# EAGLE design TSAR_Actuator_Controller (EAGLE 9.6.2)

## Sheet 1 of 3: STM Morpho Connector
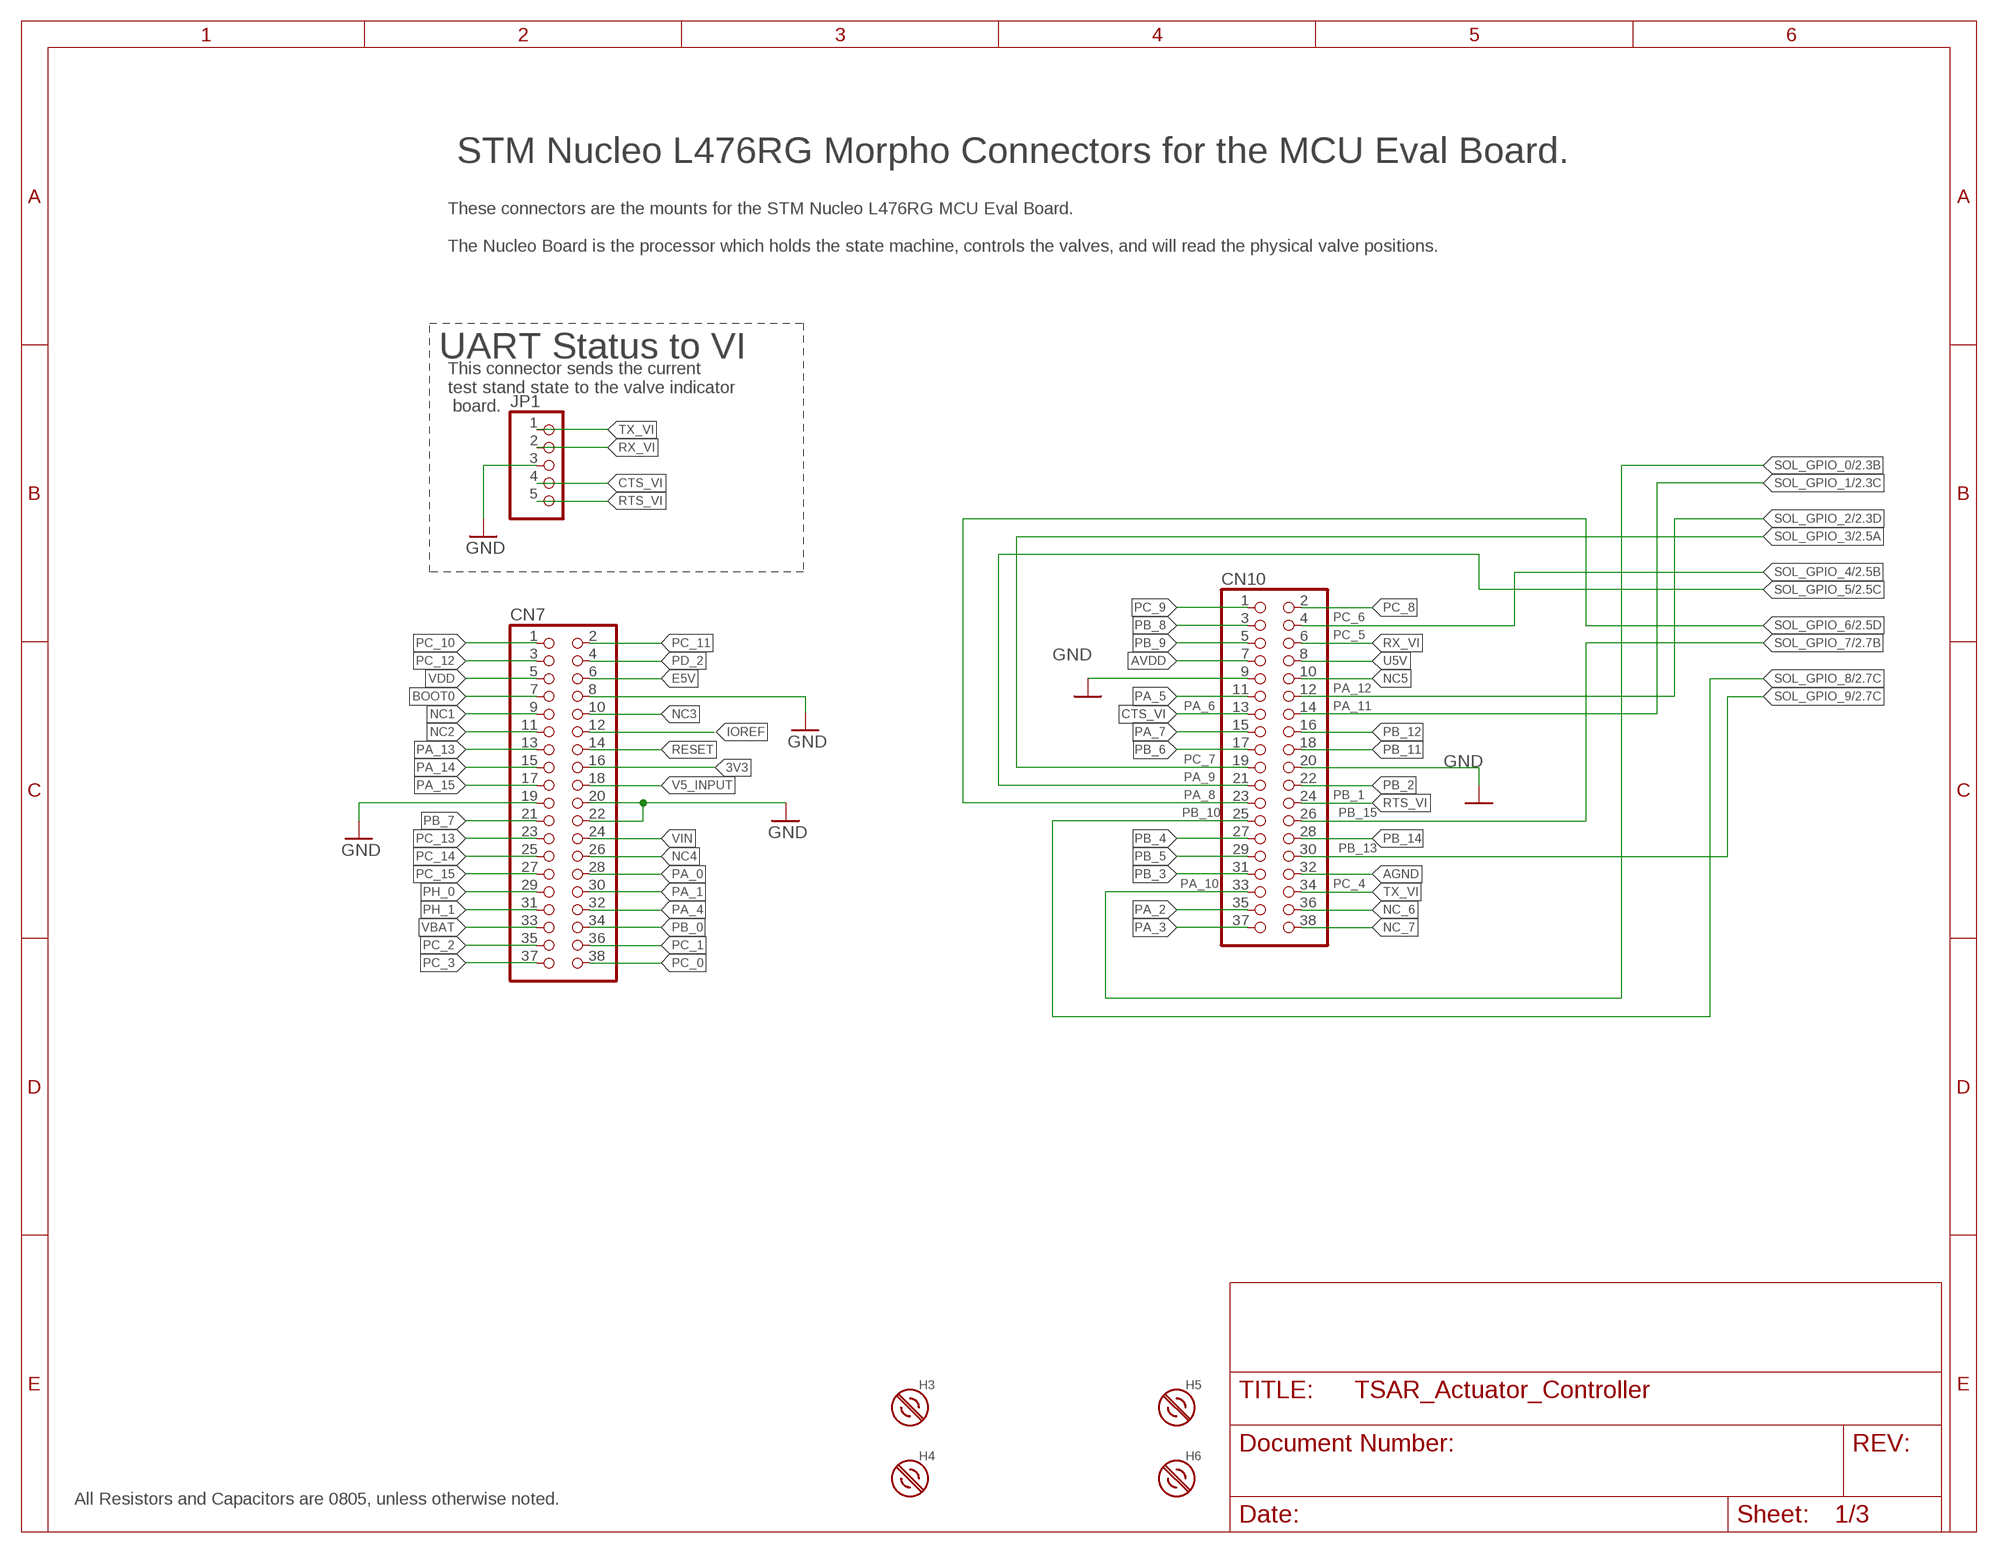
[diagram p0: schematic, sheet 1]

### Parts
CN7  PINHD-2X19  [2X19]
CN10  PINHD-2X19  [2X19]
H3  #4-BARE_MOUNTING_HOLE/.300  [#4/.300-BARE+STD_NUT_OR_STAR_WASHER]
H4  #4-BARE_MOUNTING_HOLE/.300  [#4/.300-BARE+STD_NUT_OR_STAR_WASHER]
H5  #4-BARE_MOUNTING_HOLE/.300  [#4/.300-BARE+STD_NUT_OR_STAR_WASHER]
H6  #4-BARE_MOUNTING_HOLE/.300  [#4/.300-BARE+STD_NUT_OR_STAR_WASHER]
JP1  PINHD-1X5  [1X05]

### Nets
3V3: CN7.16
AGND: CN10.32
AVDD: CN10.7
BOOT0: CN7.7
CTS_VI: CN10.13 JP1.4
E5V: CN7.6
GND: CN7.8 CN7.19 CN7.20 CN7.22 CN10.9 CN10.20 JP1.3 ; also sheet 2,3
IOREF: CN7.12
NC1: CN7.9
NC2: CN7.11
NC3: CN7.10
NC4: CN7.26
NC5: CN10.10
NC_6: CN10.36
NC_7: CN10.38
PA_0: CN7.28
PA_1: CN7.30
PA_2: CN10.35
PA_3: CN10.37
PA_4: CN7.32
PA_5: CN10.11
PA_7: CN10.15
PA_13: CN7.13
PA_14: CN7.15
PA_15: CN7.17
PB_0: CN7.34
PB_2: CN10.22
PB_3: CN10.31
PB_4: CN10.27
PB_5: CN10.29
PB_6: CN10.17
PB_7: CN7.21
PB_8: CN10.3
PB_9: CN10.5
PB_11: CN10.18
PB_12: CN10.16
PB_14: CN10.28
PC_0: CN7.38
PC_1: CN7.36
PC_2: CN7.35
PC_3: CN7.37
PC_8: CN10.2
PC_9: CN10.1
PC_10: CN7.1
PC_11: CN7.2
PC_12: CN7.3
PC_13: CN7.23
PC_14: CN7.25
PC_15: CN7.27
PD_2: CN7.4
PH_0: CN7.29
PH_1: CN7.31
RESET: CN7.14
RTS_VI: CN10.24 JP1.5
RX_VI: CN10.6 JP1.2
SOL_GPIO_0: CN10.33 ; also sheet 2
SOL_GPIO_1: CN10.14 ; also sheet 2
SOL_GPIO_2: CN10.12 ; also sheet 2
SOL_GPIO_3: CN10.19 ; also sheet 2
SOL_GPIO_4: CN10.4 ; also sheet 2
SOL_GPIO_5: CN10.21 ; also sheet 2
SOL_GPIO_6: CN10.23 ; also sheet 2
SOL_GPIO_7: CN10.26 ; also sheet 2
SOL_GPIO_8: CN10.25 ; also sheet 2
SOL_GPIO_9: CN10.30 ; also sheet 2
TX_VI: CN10.34 JP1.1
U5V: CN10.8
V5_INPUT: CN7.18
VBAT: CN7.33
VDD: CN7.5
VIN: CN7.24

### Notes on the sheet
- STM Nucleo L476RG Morpho Connectors for the MCU Eval Board.
- These connectors are the mounts for the STM Nucleo L476RG MCU Eval Board. 
  
  The Nucleo Board is the processor which holds the state machine, controls the valves, and will read the physical valve positions.
- UART Status to VI
- This connector sends the current 
  test stand state to the valve indicator
   board.
- PC_6
- PC_5
- PA_12
- PA_6 | PA_11
- PC_7
- PA_9
- PA_8 | PB_1
- PB_10 | PB_15
- PB_13
- PA_10 | PC_4
- All Resistors and Capacitors are 0805, unless otherwise noted.

## Sheet 2 of 3: Solenoid Switches
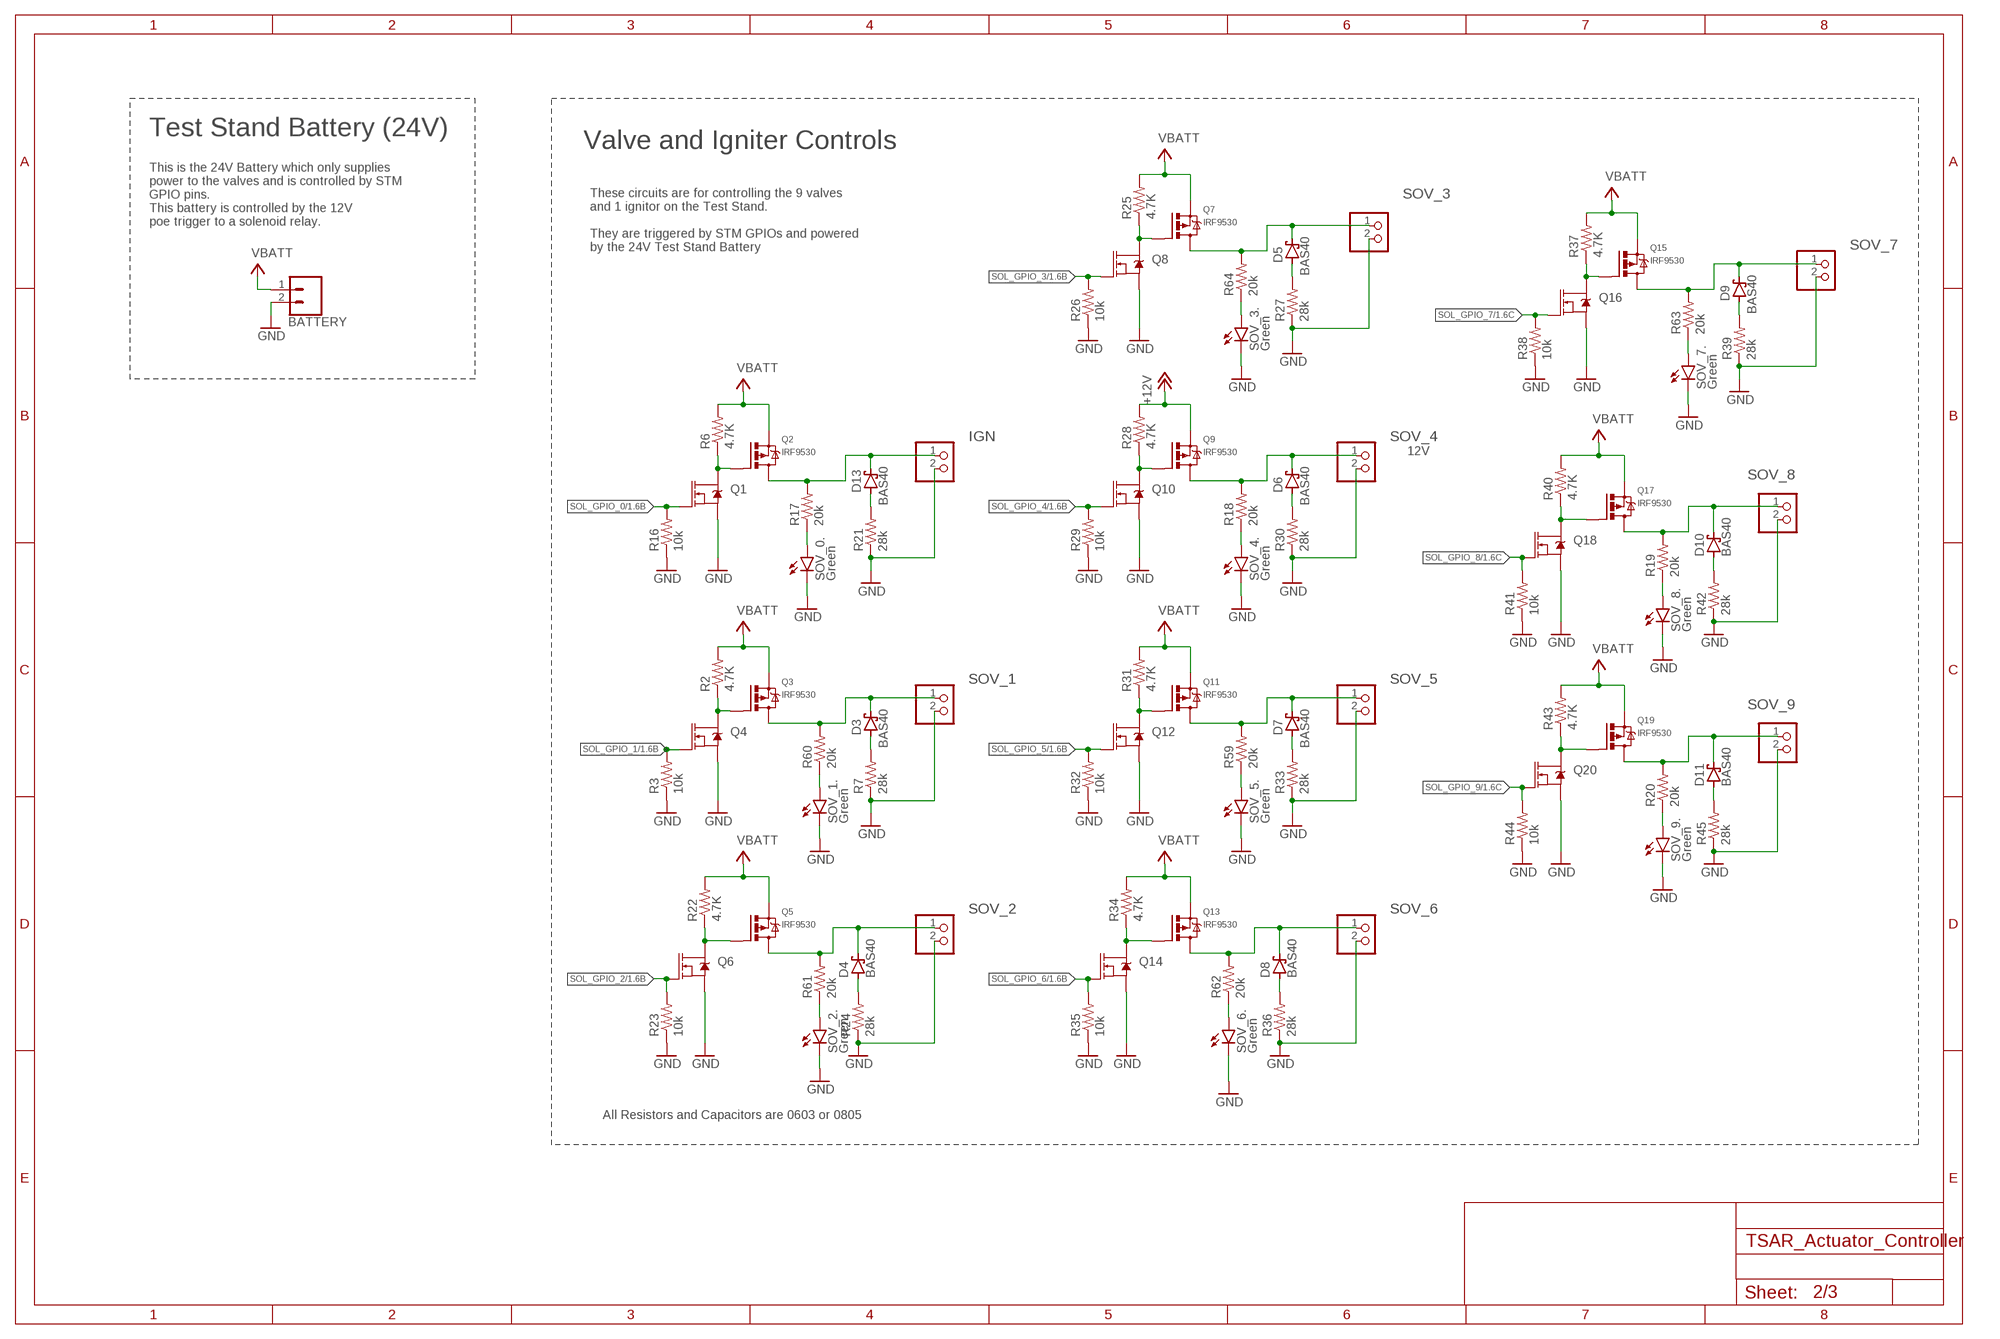
[diagram p1: schematic, sheet 2]

### Parts
BATTERY  CONN_02PTH4  [1X02_XTRA_BIG]
D3  BAS40  [SOT23]
D4  BAS40  [SOT23]
D5  BAS40  [SOT23]
D6  BAS40  [SOT23]
D7  BAS40  [SOT23]
D8  BAS40  [SOT23]
D9  BAS40  [SOT23]
D10  BAS40  [SOT23]
D11  BAS40  [SOT23]
D13  BAS40  [SOT23]
IGN  PINHD-1X2  [1X02]
Q1  220mA/50V/3.5Ω  MOSFET-NCH-BSS138  [SOT23-3]
Q2  IRF9530  [TO220BV]
Q3  IRF9530  [TO220BV]
Q4  220mA/50V/3.5Ω  MOSFET-NCH-BSS138  [SOT23-3]
Q5  IRF9530  [TO220BV]
Q6  220mA/50V/3.5Ω  MOSFET-NCH-BSS138  [SOT23-3]
Q7  IRF9530  [TO220BV]
Q8  220mA/50V/3.5Ω  MOSFET-NCH-BSS138  [SOT23-3]
Q9  IRF9530  [TO220BV]
Q10  220mA/50V/3.5Ω  MOSFET-NCH-BSS138  [SOT23-3]
Q11  IRF9530  [TO220BV]
Q12  220mA/50V/3.5Ω  MOSFET-NCH-BSS138  [SOT23-3]
Q13  IRF9530  [TO220BV]
Q14  220mA/50V/3.5Ω  MOSFET-NCH-BSS138  [SOT23-3]
Q15  IRF9530  [TO220BV]
Q16  220mA/50V/3.5Ω  MOSFET-NCH-BSS138  [SOT23-3]
Q17  IRF9530  [TO220BV]
Q18  220mA/50V/3.5Ω  MOSFET-NCH-BSS138  [SOT23-3]
Q19  IRF9530  [TO220BV]
Q20  220mA/50V/3.5Ω  MOSFET-NCH-BSS138  [SOT23-3]
R2  4.7K  R-US_0805-A-NOSILK  [.0805-A-NOSILK]
R3  10k  R-US_0805-A-NOSILK  [.0805-A-NOSILK]
R6  4.7K  R-US_0805-A-NOSILK  [.0805-A-NOSILK]
R7  28k  R-US_0805-A-NOSILK  [.0805-A-NOSILK]
R16  10k  R-US_0805-A-NOSILK  [.0805-A-NOSILK]
R17  20k  R-US_0603-A-NOSILK  [.0603-A-NOSILK]
R18  20k  R-US_0603-A-NOSILK  [.0603-A-NOSILK]
R19  20k  R-US_0603-A-NOSILK  [.0603-A-NOSILK]
R20  20k  R-US_0603-A-NOSILK  [.0603-A-NOSILK]
R21  28k  R-US_0805-A-NOSILK  [.0805-A-NOSILK]
R22  4.7K  R-US_0805-A-NOSILK  [.0805-A-NOSILK]
R23  10k  R-US_0805-A-NOSILK  [.0805-A-NOSILK]
R24  28k  R-US_0805-A-NOSILK  [.0805-A-NOSILK]
R25  4.7K  R-US_0805-A-NOSILK  [.0805-A-NOSILK]
R26  10k  R-US_0805-A-NOSILK  [.0805-A-NOSILK]
R27  28k  R-US_0805-A-NOSILK  [.0805-A-NOSILK]
R28  4.7K  R-US_0805-A-NOSILK  [.0805-A-NOSILK]
R29  10k  R-US_0805-A-NOSILK  [.0805-A-NOSILK]
R30  28k  R-US_0805-A-NOSILK  [.0805-A-NOSILK]
R31  4.7K  R-US_0805-A-NOSILK  [.0805-A-NOSILK]
R32  10k  R-US_0805-A-NOSILK  [.0805-A-NOSILK]
R33  28k  R-US_0805-A-NOSILK  [.0805-A-NOSILK]
R34  4.7K  R-US_0805-A-NOSILK  [.0805-A-NOSILK]
R35  10k  R-US_0805-A-NOSILK  [.0805-A-NOSILK]
R36  28k  R-US_0805-A-NOSILK  [.0805-A-NOSILK]
R37  4.7K  R-US_0805-A-NOSILK  [.0805-A-NOSILK]
R38  10k  R-US_0805-A-NOSILK  [.0805-A-NOSILK]
R39  28k  R-US_0805-A-NOSILK  [.0805-A-NOSILK]
R40  4.7K  R-US_0805-A-NOSILK  [.0805-A-NOSILK]
R41  10k  R-US_0805-A-NOSILK  [.0805-A-NOSILK]
R42  28k  R-US_0805-A-NOSILK  [.0805-A-NOSILK]
R43  4.7K  R-US_0805-A-NOSILK  [.0805-A-NOSILK]
R44  10k  R-US_0805-A-NOSILK  [.0805-A-NOSILK]
R45  28k  R-US_0805-A-NOSILK  [.0805-A-NOSILK]
R59  20k  R-US_0603-A-NOSILK  [.0603-A-NOSILK]
R60  20k  R-US_0603-A-NOSILK  [.0603-A-NOSILK]
R61  20k  R-US_0603-A-NOSILK  [.0603-A-NOSILK]
R62  20k  R-US_0603-A-NOSILK  [.0603-A-NOSILK]
R63  20k  R-US_0603-A-NOSILK  [.0603-A-NOSILK]
R64  20k  R-US_0603-A-NOSILK  [.0603-A-NOSILK]
SOV_0.  Green  LEDCHIP-LED0603  [CHIP-LED0603]
SOV_1  PINHD-1X2  [1X02]
SOV_1.  Green  LEDCHIP-LED0603  [CHIP-LED0603]
SOV_2  PINHD-1X2  [1X02]
SOV_2.  Green  LEDCHIP-LED0603  [CHIP-LED0603]
SOV_3  PINHD-1X2  [1X02]
SOV_3.  Green  LEDCHIP-LED0603  [CHIP-LED0603]
SOV_4  PINHD-1X2  [1X02]
SOV_4.  Green  LEDCHIP-LED0603  [CHIP-LED0603]
SOV_5  PINHD-1X2  [1X02]
SOV_5.  Green  LEDCHIP-LED0603  [CHIP-LED0603]
SOV_6  PINHD-1X2  [1X02]
SOV_6.  Green  LEDCHIP-LED0603  [CHIP-LED0603]
SOV_7  PINHD-1X2  [1X02]
SOV_7.  Green  LEDCHIP-LED0603  [CHIP-LED0603]
SOV_8  PINHD-1X2  [1X02]
SOV_8.  Green  LEDCHIP-LED0603  [CHIP-LED0603]
SOV_9  PINHD-1X2  [1X02]
SOV_9.  Green  LEDCHIP-LED0603  [CHIP-LED0603]

### Nets
+12V: Q9.S R28.2 ; also sheet 3
GND: BATTERY.2 IGN.2 Q1.2(S) Q4.2(S) Q6.2(S) Q8.2(S) Q10.2(S) Q12.2(S) Q14.2(S) Q16.2(S) Q18.2(S) Q20.2(S) R3.1 R7.1 R16.1 R21.1 R23.1 R24.1 R26.1 R27.1 R29.1 R30.1 R32.1 R33.1 R35.1 R36.1 R38.1 R39.1 R41.1 R42.1 R44.1 R45.1 SOV_0..C SOV_1.2 SOV_1..C SOV_2.2 SOV_2..C SOV_3.2 SOV_3..C SOV_4.2 SOV_4..C SOV_5.2 SOV_5..C SOV_6.2 SOV_6..C SOV_7.2 SOV_7..C SOV_8.2 SOV_8..C SOV_9.2 SOV_9..C ; also sheet 1,3
N$1: Q1.3(D) Q2.G R6.1
N$2: R17.1 SOV_0..A
N$16: R18.1 SOV_4..A
N$17: R19.1 SOV_8..A
N$18: R20.1 SOV_9..A
N$20: R59.1 SOV_5..A
N$21: R60.1 SOV_1..A
N$22: R61.1 SOV_2..A
N$23: R62.1 SOV_6..A
N$24: R63.1 SOV_7..A
N$25: R64.1 SOV_3..A
N$29: D3.1(A) R7.2
N$30: Q3.G Q4.3(D) R2.1
N$31: D4.1(A) R24.2
N$32: Q5.G Q6.3(D) R22.1
N$33: D5.1(A) R27.2
N$34: Q7.G Q8.3(D) R25.1
N$36: D6.1(A) R30.2
N$37: Q9.G Q10.3(D) R28.1
N$38: D7.1(A) R33.2
N$39: Q11.G Q12.3(D) R31.1
N$40: D8.1(A) R36.2
N$41: Q13.G Q14.3(D) R34.1
N$42: D9.1(A) R39.2
N$43: Q15.G Q16.3(D) R37.1
N$44: D10.1(A) R42.2
N$45: Q17.G Q18.3(D) R40.1
N$46: D11.1(A) R45.2
N$47: Q19.G Q20.3(D) R43.1
N$54: D13.1(A) R21.2
SOL_GPIO_0: Q1.1(G) R16.2 ; also sheet 1
SOL_GPIO_1: Q4.1(G) R3.2 ; also sheet 1
SOL_GPIO_2: Q6.1(G) R23.2 ; also sheet 1
SOL_GPIO_3: Q8.1(G) R26.2 ; also sheet 1
SOL_GPIO_4: Q10.1(G) R29.2 ; also sheet 1
SOL_GPIO_5: Q12.1(G) R32.2 ; also sheet 1
SOL_GPIO_6: Q14.1(G) R35.2 ; also sheet 1
SOL_GPIO_7: Q16.1(G) R38.2 ; also sheet 1
SOL_GPIO_8: Q18.1(G) R41.2 ; also sheet 1
SOL_GPIO_9: Q20.1(G) R44.2 ; also sheet 1
SOL_GPIO_10: D13.3(C) IGN.1 Q2.D R17.2
SOL_GPIO_11: D3.3(C) Q3.D R60.2 SOV_1.1
SOL_GPIO_12: D4.3(C) Q5.D R61.2 SOV_2.1
SOL_GPIO_13: D5.3(C) Q7.D R64.2 SOV_3.1
SOL_GPIO_14: D6.3(C) Q9.D R18.2 SOV_4.1
SOL_GPIO_15: D7.3(C) Q11.D R59.2 SOV_5.1
SOL_GPIO_16: D8.3(C) Q13.D R62.2 SOV_6.1
SOL_GPIO_17: D9.3(C) Q15.D R63.2 SOV_7.1
SOL_GPIO_18: D10.3(C) Q17.D R19.2 SOV_8.1
SOL_GPIO_19: D11.3(C) Q19.D R20.2 SOV_9.1
VBATT: BATTERY.1 Q2.S Q3.S Q5.S Q7.S Q11.S Q13.S Q15.S Q17.S Q19.S R2.2 R6.2 R22.2 R25.2 R31.2 R34.2 R37.2 R40.2 R43.2 ; also sheet 3

### Notes on the sheet
- Test Stand Battery (24V)
- Valve and Igniter Controls
- This is the 24V Battery which only supplies
  power to the valves and is controlled by STM 
  GPIO pins. 
  This battery is controlled by the 12V 
  poe trigger to a solenoid relay.
- These circuits are for controlling the 9 valves 
  and 1 ignitor on the Test Stand.
  
  They are triggered by STM GPIOs and powered 
  by the 24V Test Stand Battery
- 12V
- All Resistors and Capacitors are 0603 or 0805

## Sheet 3 of 3: Regulator
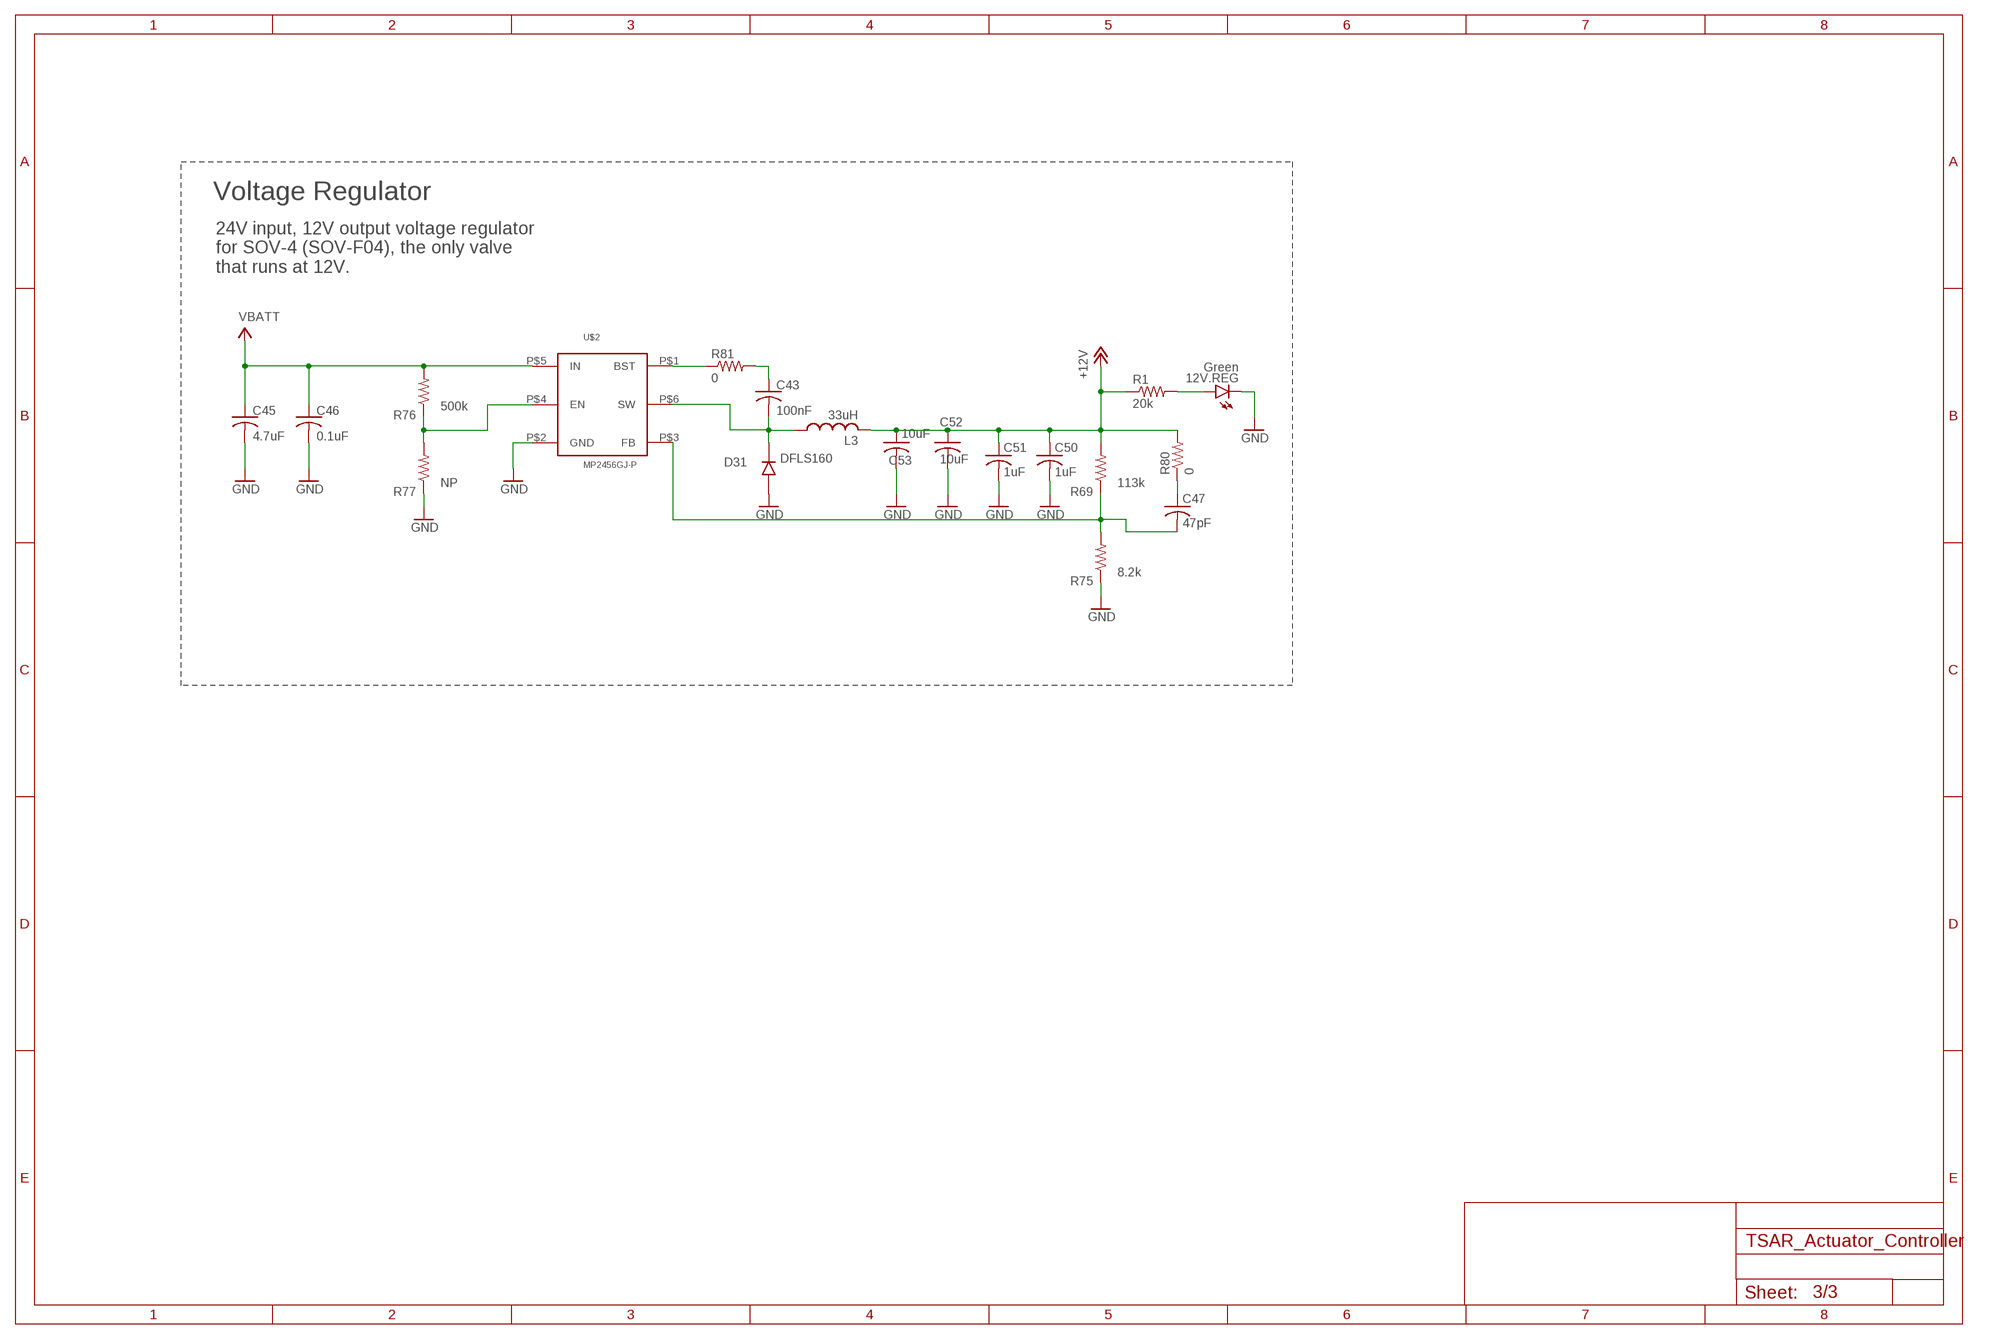
[diagram p2: schematic, sheet 3]

### Parts
12V.REG  Green  LEDCHIP-LED0603  [CHIP-LED0603]
C43  100nF  C-USC0603K  [C0603K]
C45  4.7uF  C-USC0805K  [C0805K]
C46  0.1uF  C-USC0603K  [C0603K]
C47  47pF  C-USC0603K  [C0603K]
C50  1uF  C-USC0603K  [C0603K]
C51  1uF  C-USC0603K  [C0603K]
C52  10uF  C-USC1206K  [C1206K]
C53  10uF  C-USC1206K  [C1206K]
D31  DFLS160  DFLS160-7  [POWERDI-123]
L3  33uH  CLF5030NIT-100M-D  [0.209"LX0.197"W(5.30MMX5.00MM)]
R1  20k  R-US_0603-A-NOSILK  [.0603-A-NOSILK]
R69  113k  R-US_0805-A-NOSILK  [.0805-A-NOSILK]
R75  8.2k  R-US_0805-A-NOSILK  [.0805-A-NOSILK]
R76  500k  R-US_1206-A  [1206-A]
R77  NP  R-US_0805-A-NOSILK  [.0805-A-NOSILK]
R80  0  R-US_0603-A-NOSILK  [.0603-A-NOSILK]
R81  0  R-US_0603-A-NOSILK  [.0603-A-NOSILK]
U$2  MP2456GJ-P  [SOT6]

### Nets
+12V: C50.1 C51.1 C52.1 C53.1 L3.2 R1.1 R69.2 R80.2 ; also sheet 2
FLY3: C43.2 D31.C L3.1 U$2.P$6(SW)
GND: 12V.REG.C C45.2 C46.2 C50.2 C51.2 C52.2 C53.2 D31.A R75.1 R77.1 U$2.P$2(GND) ; also sheet 1,2
N$3: 12V.REG.A R1.2
N$11: C43.1 R81.2
N$12: C47.2 R69.1 R75.2 U$2.P$3(FB)
N$13: R76.1 R77.2 U$2.P$4(EN)
N$14: C47.1 R80.1
N$15: R81.1 U$2.P$1(BST)
VBATT: C45.1 C46.1 R76.2 U$2.P$5(IN) ; also sheet 2

### Notes on the sheet
- Voltage Regulator
- 24V input, 12V output voltage regulator
  for SOV-4 (SOV-F04), the only valve 
  that runs at 12V.

## Library data of the parts
12V.REG SOV_0. SOV_1. SOV_2. SOV_3. SOV_4. SOV_5. SOV_6. SOV_7. SOV_8. SOV_9. = led:LED: LED OSRAM: - CHIPLED LG R971, LG N971, LY N971, LG Q971, LY Q971, LO R971, LY R971 LH N974, LH R974 LS Q976, LO Q976, LY Q976 LO Q996 - Hyper CHIPLED LW Q18S LB Q993, LB Q99A, LB R99A - SideLED LS A670, LO A670, LY A670, LG A670, LP A670 LB A673, LV A673, LT A673, LW A673 LH A674 LY A675 LS A676, LA A676, LO A676, LY A676, LW A676 LS A679, LY A679, LG A679 - Hyper Micro SIDELED® LS Y876, LA Y876, LO Y876, LY Y876 LT Y87S - SmartLED LW L88C, LW L88S LB L89C, LB L89S, LG L890 LS L89K, LO L89K, LY L89K LS L896, LA L896, LO L896, LY L896 - TOPLED LS T670, LO T670, LY T670, LG T670, LP T670 LSG T670, LSP T670, LSY T670, LOP T670, LYG T670 LG T671, LOG T671, LSG T671 LB T673, LV T673, LT T673, LW T673 LH T674 LS T676, LA T676, LO T676, LY T676, LB T676, LH T676, LSB T676, LW T676 LB T67C, LV T67C, LT T67C, LS T67K, LO T67K, LY T67K, LW E67C LS E67B, LA E67B, LO E67B, LY E67B, LB E67C, LV E67C, LT E67C LW T67C LS T679, LY T679, LG T679 LS T770, LO T770, LY T770, LG T770, LP T770 LB T773, LV T773, LT T773, LW T773 LH T774 LS E675, LA E675, LY E675, LS T675 LS T776, LA T776, LO T776, LY T776, LB T776 LHGB T686 LT T68C, LB T68C - Hyper Mini TOPLED® LB M676 - Mini TOPLED Santana® LG M470 LS M47K, LO M47K, LY M47K Source: http://www.osram.convergy.de LUXEON: - LUMILED® LXK2-PW12-R00, LXK2-PW12-S00, LXK2-PW14-U00, LXK2-PW14-V00 LXK2-PM12-R00, LXK2-PM12-S00, LXK2-PM14-U00 LXK2-PE12-Q00, LXK2-PE12-R00, LXK2-PE12-S00, LXK2-PE14-T00, LXK2-PE14-U00 LXK2-PB12-K00, LXK2-PB12-L00, LXK2-PB12-M00, LXK2-PB14-N00, LXK2-PB14-P00, LXK2-PB14-Q00 LXK2-PR12-L00, LXK2-PR12-M00, LXK2-PR14-Q00, LXK2-PR14-R00 LXK2-PD12-Q00, LXK2-PD12-R00, LXK2-PD12-S00 LXK2-PH12-R00, LXK2-PH12-S00 LXK2-PL12-P00, LXK2-PL12-Q00, LXK2-PL12-R00 Source: www.luxeon.com KINGBRIGHT: KA-3528ASYC Source: www.kingbright.com; DIS: Digi-Key; DPN: 350-2035-1-ND; MFR: Dialight; MPN: 5988070107F
BATTERY = SparkFun-Connectors:CONN_02: Multi connection point. Often used as Generic Header-pin footprint for 0.1 inch spaced/style header connections On any of the 0.1 inch spaced packages, you can populate with these: Break Away Headers - Straight <https://www.sparkfun.com/products/116> (PRT-00116) Break Away Male Headers - Right Angle <https://www.sparkfun.com/products/553> (PRT-00553) Female Headers <https://www.sparkfun.com/products/115> (PRT-00115) Break Away Headers - Machine Pin <https://www.sparkfun.com/products/117> (PRT-00117) Break Away Female Headers - Swiss Machine Pin <https://www.sparkfun.com/products/743> (PRT-00743) For SCREWTERMINALS and SPRING TERMINALS visit here: Screw Terimnals on SparkFun.com <https://www.sparkfun.com/search/results?term=Screw+Terminals> (5mm/3.5mm/2.54mm spacing) This device is also useful as a general connection point to wire up your design to another part of your project. Our various solder wires solder well into these plated through hole pads. Hook-Up Wire - Assortment (Stranded, 22 AWG) <https://www.sparkfun.com/products/11375> (PRT-11375) Hook-Up Wire - Assortment (Solid Core, 22 AWG) <https://www.sparkfun.com/products/11367> (PRT-11367) View the entire wire category on our website here <https://www.sparkfun.com/categories/141> Special notes: Molex polarized connector foot print use with: PRT-08233 with associated crimp pins and housings. 2.54_SCREWTERM for use with PRT-10571. 3.5mm Screw Terminal footprints for PRT-08084 5mm Screw Terminal footprints for use with PRT-08432; DIS: Digi-Key; DPN: A113320-ND; MFR: TE Connectivity AMP Connectors; MPN: 282837-2
C43 C46 = oresat-rcl:C-US: CAPACITOR, American symbol; DIS: Digi-Key; DPN: 1276-CL10B104KB8NNNLCT-ND; MFR: Samsung Electro-Mechanics; MPN: CL10B104KB8NNNL
C45 = oresat-rcl:C-US: CAPACITOR, American symbol; DIS: Digi-Key; DPN: 1276-1248-1-ND; MFR: Samsung Electro-Mechanics; MPN: CL21A475KBQNNNE
C47 = oresat-rcl:C-US: CAPACITOR, American symbol; DIS: Digi-Key; DPN: 445-1277-1-ND; MFR: TDK Corporation; MPN: C1608C0G1H470J080AA
C50 C51 = oresat-rcl:C-US: CAPACITOR, American symbol; DIS: Digi-Key; DPN: 1276-1860-1-ND; MFR: Samsung Electro-Mechanics; MPN: CL10A105KB8NNNC
C52 C53 = oresat-rcl:C-US: CAPACITOR, American symbol; DIS: Digi-Key; DPN: 1276-6736-1-ND; MFR: Samsung Electro-Mechanics; MPN: CL31A106MBHNNNE
CN7 CN10 = pinhead:PINHD-2X19: PIN HEADER; DIS: Digi-Key; DPN: S7122-ND; MFR: Sullins Connector Solutions; MPN: PPPC192LFBN-RC
D3-D11 D13 = diode:BAS40: Silicon Schottky Diodes General-purpose diode for high-speed switching; DIS: Digi-Key; DPN: 1514-CMPSH1-4TRPBFREECT-ND; MFR: Central Semiconductor Corp; MPN: CMPSH1-4 TR PBFREE
D31 = DFLS160-7:DFLS160-7; DESCRIPTION: Diode Schottky 60V 1A Surface Mount PowerDI™ 123; DIGI-KEY_PART_NUMBER: DFLS160DICT-ND; DIS: Digi-Key; DPN: DFLS160DICT-ND; MF: Diodes Inc.; MFR: Diodes Incorporated; MP: DFLS160-7; MPN: DFLS160-7; PACKAGE: POWERDI®123 Diodes Incorporated; PURCHASE-URL: https://pricing.snapeda.com/search/part/DFLS160-7/?ref=eda
H3-H6 = mount:#4-BARE_MOUNTING_HOLE: 1/8" drill hole for #4 screw mount
IGN SOV_1-SOV_9 = pinhead:PINHD-1X2: PIN HEADER; DIS: Digi-Key; DPN: 900-0022232021-ND; MFR: Molex; MPN: 0022232021
JP1 = pinhead:PINHD-1X5: PIN HEADER; DIS: Digi-Key; DPN: AE11083-ND; MFR: Molex; MPN: AWHW 10A-0202-T
L3 = TSAR_Controller (2):CLF5030NIT-100M-D; DIS: Digi-Key; DPN: 553-PM4340.333NLTCT-ND; MFR: Pulse Electronics Power; MPN: PM4340.333NLT
Q1 Q4 Q6 Q8 Q10 Q12 Q14 Q16 Q18 Q20 = SparkFun-DiscreteSemi:MOSFET-NCH: N-channel MOSFETs Voltage controlled devices that allow control of high current outputs. SparkFun Products: SparkFun OpenScale <https://www.sparkfun.com/products/13261> SparkFun Digital Sandbox <https://www.sparkfun.com/products/12651> SparkFun Monster Moto Shield <https://www.sparkfun.com/products/10182> SparkFun MOSFET Power Controller <https://www.sparkfun.com/products/11214>; DIS: Digi-Key; DPN: 1727-1142-1-ND; MFR: Nexperia USA Inc.; MPN: BSS138P,215; PROD_ID: TRANS-00830
Q2 Q3 Q5 Q7 Q9 Q11 Q13 Q15 Q17 Q19 = transistor-power:IRF9530: P-CHANNEL HEXFET POWER-MOS-FET Source: http://www.irf.com/product-info/datasheets/data/irf9530.pdf; DIS: Digi-Key; DPN: IRF9530NPBF-ND; MFR: Infineon Technologies; MPN: IRF9530NPBF
R1 = oresat-rcl:R-US_: RESISTOR, American symbol; DIS: Digi-Key; DPN: P20KBZCT-ND; MFR: Panasonic Electronic Components; MPN: ERJ-PA3J203V
R2 R6 R22 R25 R28 R31 R34 R37 R40 R43 = oresat-rcl:R-US_: RESISTOR, American symbol; DIS: Digi-Key; DPN: 311-4.70KCRCT-ND; MFR: Yageo; MPN: RC0805FR-074K7L
R3 R16 R23 R26 R29 R32 R35 R38 R41 R44 = oresat-rcl:R-US_: RESISTOR, American symbol; DIS: Digi-Key; DPN: 311-10.0KCRCT-ND; MFR: Yageo; MPN: RC0805FR-0710KL
R7 R21 R24 R27 R30 R33 R36 R39 R42 R45 = oresat-rcl:R-US_: RESISTOR, American symbol; DIS: Digi-Key; DPN: RMCF0805FT28K0CT-ND; MFR: Stackpole Electronics Inc; MPN: RMCF0805FT28K0
R17-R20 R59-R64 = oresat-rcl:R-US_: RESISTOR, American symbol; DIS: Digi-Key; DPN: RHM20KDTR-ND; MFR: Rohm Semiconductor; MPN: ESR03EZPJ203
R69 = oresat-rcl:R-US_: RESISTOR, American symbol; DIS: Digi-Key; DPN: 2019-RK73H2ATTD1133FCT-ND; MFR: KOA Speer Electronics, Inc.; MPN: RK73H2ATTD1133F
R75 = oresat-rcl:R-US_: RESISTOR, American symbol; DIS: Digi-Key; DPN: 2019-RK73H2ATTD8201FCT-ND; MFR: KOA Speer Electronics, Inc.; MPN: RK73H2ATTD8201F
R76 = oresat-rcl:R-US_: RESISTOR, American symbol; DIS: Digi-Key; DPN: BC4966CT-ND; MFR: Vishay Dale; MPN: CRMA1206AF500KFKEF
R77 = oresat-rcl:R-US_: RESISTOR, American symbol
R80 R81 = oresat-rcl:R-US_: RESISTOR, American symbol; DIS: Digi-Key; DPN: 541-2779-1-ND; MFR: Vishay Dale; MPN: RCS06030000Z0EA
U$2 = TSAR_Controller (2):MP2456GJ-P; DIS: Digi-Key; DPN: 1589-1120-1-ND; MFR: Monolithic Power Systems Inc.; MPN: MP2456GJ-P

## Board
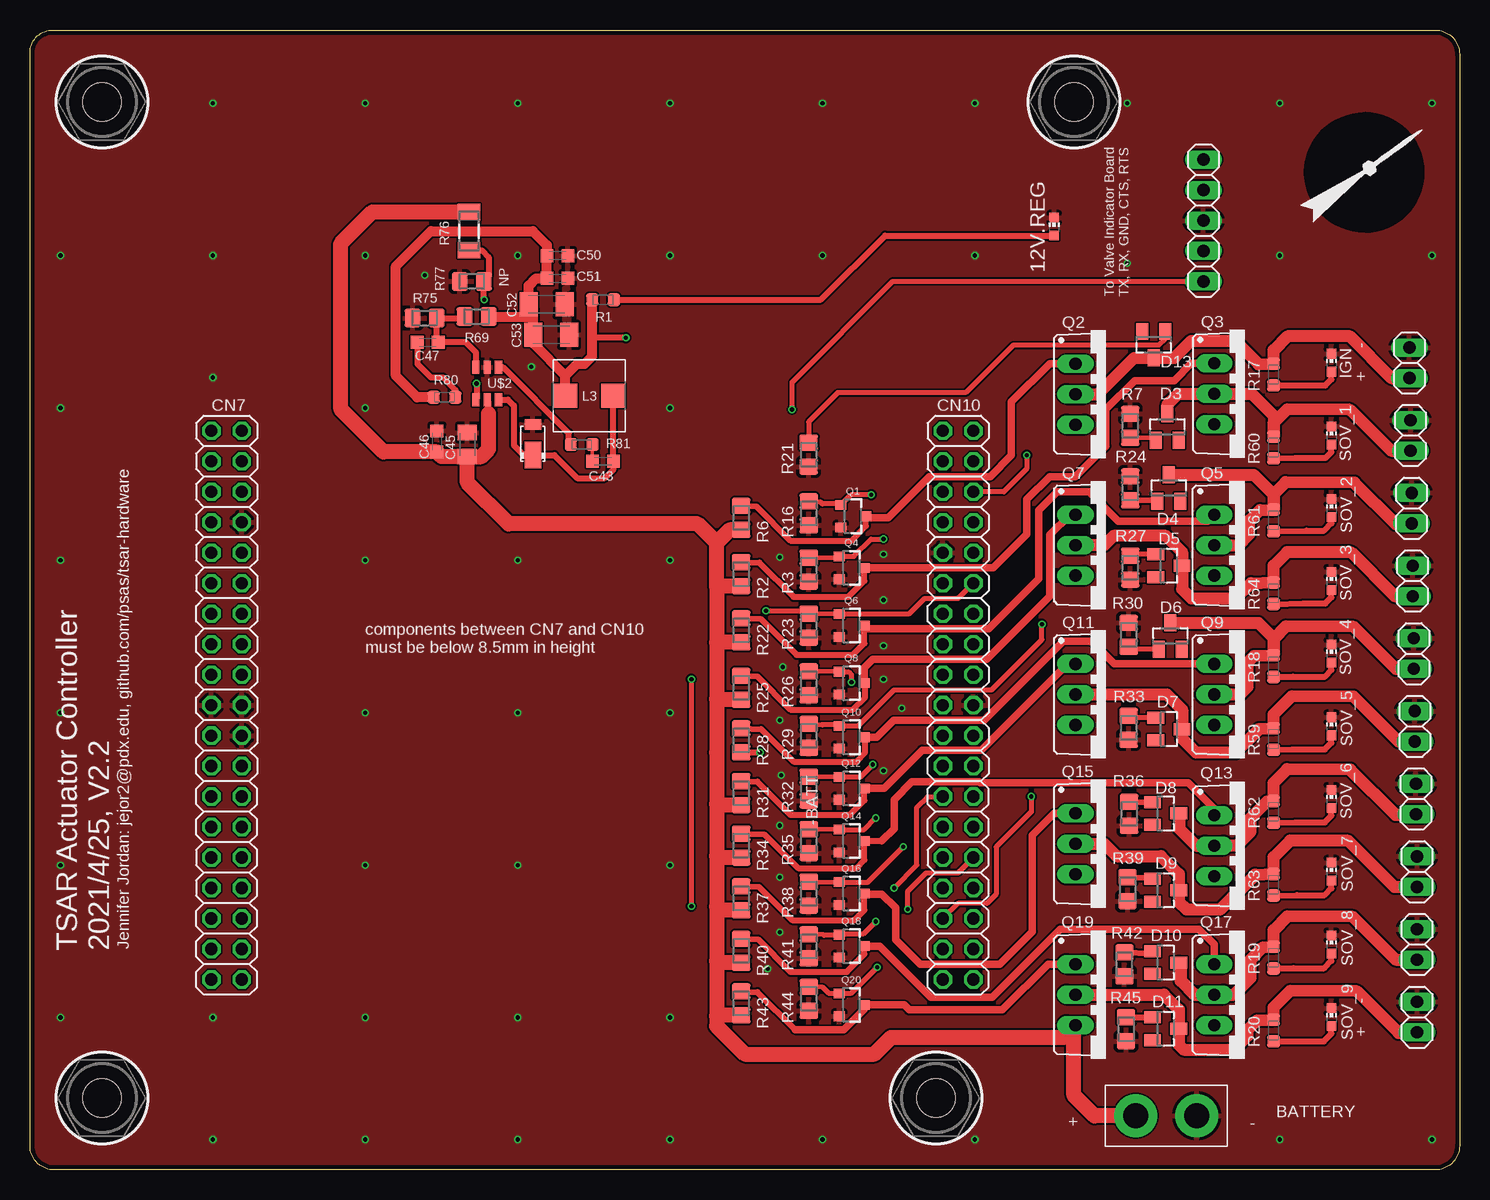
[diagram p3: board, top side]
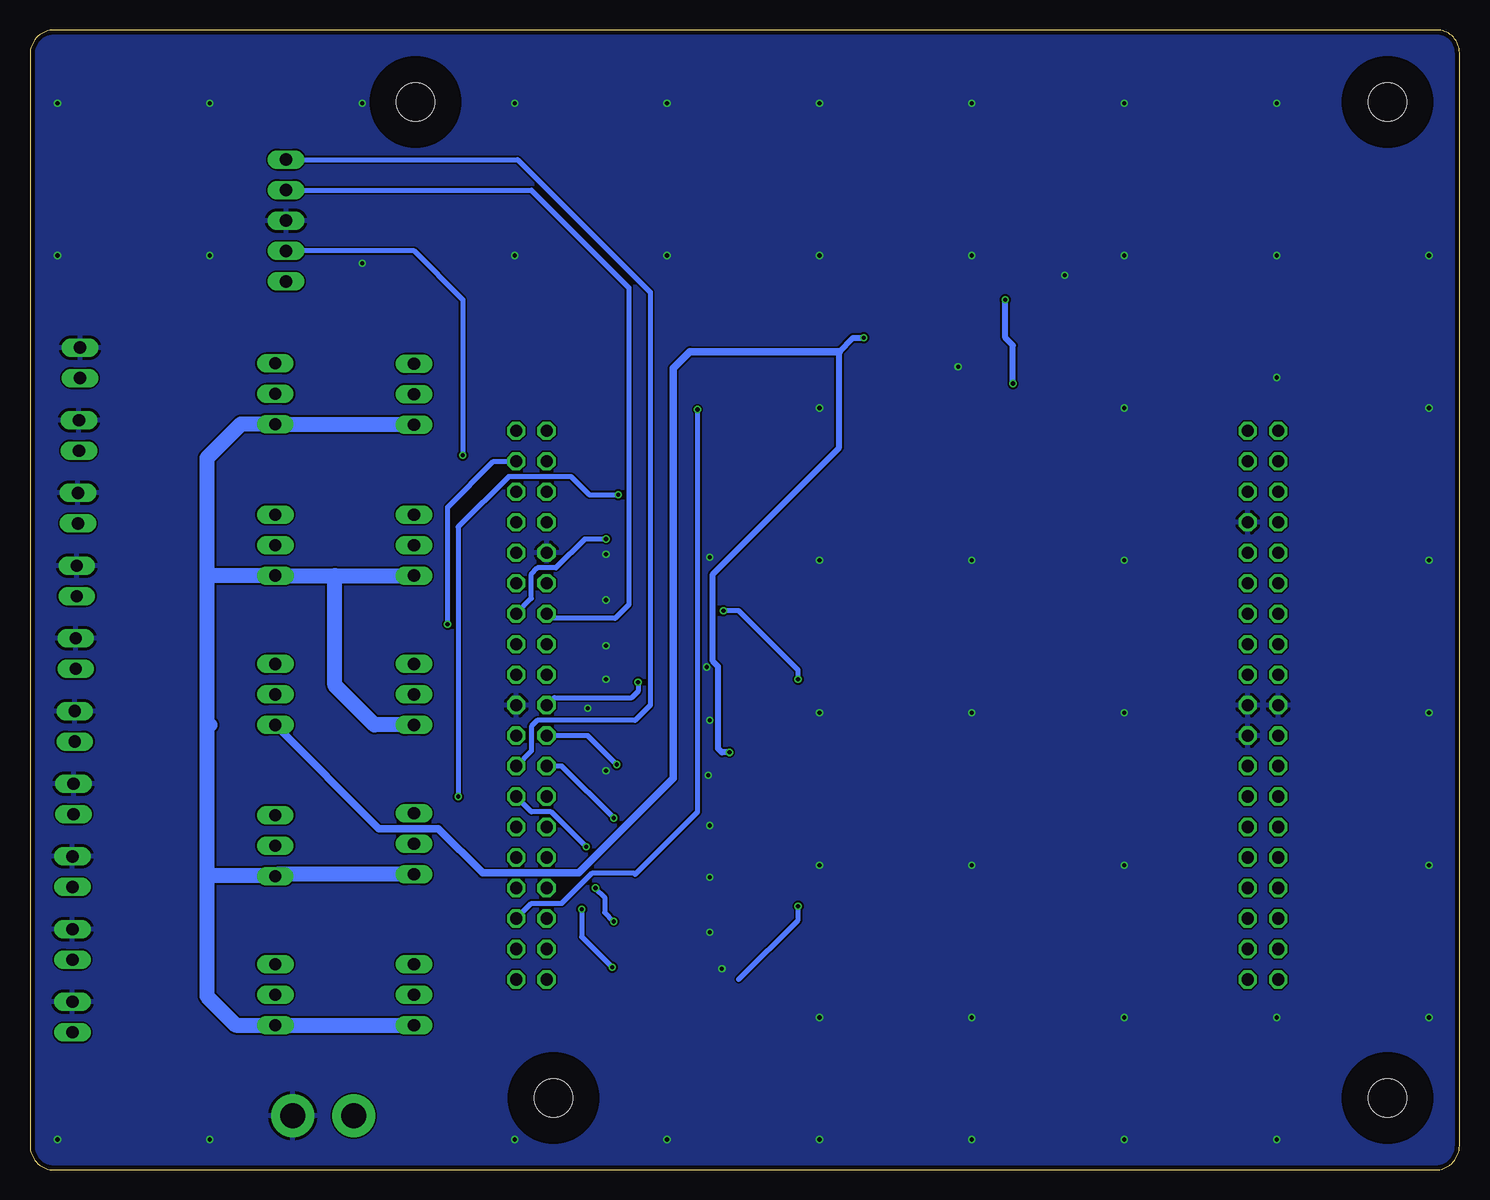
[diagram p4: board, bottom side, seen from below]

Size 119.13 x 95 mm. Coordinates in mm from the lower left corner, seen from the top.
Outline: 0,93.09 arc-90 1.91,95 117.09,95 arc-90 119.13,92.96 119.13,2.03 arc-90 117.09,0 2.03,0 arc-90 0,2.03 0,93.09
Copper layers (1*16): Top 0.035559375mm / dielectric 1.6mm / Bottom 0.035559375mm
Design rules "oshpark-2layer *": minimum track width 6mil, minimum drill 10mil, track to track 6mil, track to pad 6mil, pad to pad 6mil, via to via 6mil, smd to smd 6mil, copper to edge 15mil, drill to drill 6mil, minimum pad ring 5mil, minimum via ring 5mil, stop-mask expansion 2.5mil, vias tented up to drill 15mil, thermal gap 10mil

### Footprints (pad centres in the part's own frame; a part is rotated, then mirrored left to right if it is on the bottom)
CHIP-LED0603 = smd 0.8 x 0.8: A 0,-0.75; C 0,0.75
1X02_XTRA_BIG = drill 2.057 pad 3.556: 1 -2.54,0; 2 2.54,0
C0603K = smd 1.05 x 1.08: 1 -0.875,0; 2 0.875,0
C0805K = smd 1.3 x 1.6: 1 -1,0; 2 1,0
C1206K = smd 1.5 x 2: 1 -1.5,0; 2 1.5,0
2X19 = drill 1.016 octagon: 1 -22.86,-1.27; 2 -22.86,1.27; 3 -20.32,-1.27; 4 -20.32,1.27; 5 -17.78,-1.27; 6 -17.78,1.27; 7 -15.24,-1.27; 8 -15.24,1.27; 9 -12.7,-1.27; 10 -12.7,1.27; 11 -10.16,-1.27; 12 -10.16,1.27; 13 -7.62,-1.27; 14 -7.62,1.27; 15 -5.08,-1.27; 16 -5.08,1.27; 17 -2.54,-1.27; 18 -2.54,1.27; 19 0,-1.27; 20 0,1.27; 21 2.54,-1.27; 22 2.54,1.27; 23 5.08,-1.27; 24 5.08,1.27; 25 7.62,-1.27; 26 7.62,1.27; 27 10.16,-1.27; 28 10.16,1.27; 29 12.7,-1.27; 30 12.7,1.27; 31 15.24,-1.27; 32 15.24,1.27; 33 17.78,-1.27; 34 17.78,1.27; 35 20.32,-1.27; 36 20.32,1.27; 37 22.86,-1.27; 38 22.86,1.27
SOT23 = smd 1 x 1.4: 1 -0.95,-1.1; 2 0.95,-1.1; 3 0,1.1
POWERDI-123 = smd 0.9 x 1.4: A 2.55,0 | smd 2.2 x 1.4: C 0,0
#4/.300-BARE+STD_NUT_OR_STAR_WASHER = hole 3.175: 0,0
1X02 = drill 1.016 long: 1 -1.27,0; 2 1.27,0
1X05 = drill 1.016 long: 1 -5.08,0; 2 -2.54,0; 3 0,0; 4 2.54,0; 5 5.08,0
0.209"LX0.197"W(5.30MMX5.00MM) = smd 2 x 2: 1 -2,0; 2 2,0
SOT23-3 = smd 0.8 x 0.9: 1 -0.95,-1; 2 0.95,-1; 3 0,1.1
TO220BV = drill 1.016 long: D 0,-2.54; G -2.54,-2.54; S 2.54,-2.54
.0603-A-NOSILK = smd 1 x 1.05: 1 -0.9,0; 2 0.9,0
.0805-A-NOSILK = smd 1.35 x 1.55: 1 -1,0; 2 1,0
1206-A = smd 1.35 x 1.9: 1 -1.6,0; 2 1.6,0
SOT6 = smd 1.092 x 0.61: P$1 -1.346,0.95; P$2 -1.346,0; P$3 -1.346,-0.95; P$4 1.346,-0.95; P$5 1.346,0; P$6 1.346,0.95

### Placement (x,y rotation side)
12V.REG  85.34,78.61 0 top
BATTERY  94.68,4.51 0 top
C43  47.75,59.05 0 top
C45  36.45,60.45 90 top
C46  33.91,60.71 90 top
C47  33.15,68.96 0 top
C50  43.94,76.2 0 top
C51  43.94,74.3 0 top
C52  43.05,72.14 0 top
C53  43.43,69.6 0 top
CN7  16.38,38.73 270 top
CN10  77.34,38.73 270 top
D3  94.78,61.92 0 top
D4  94.9,56.82 0 top
D5  94.9,50.35 270 top
D6  95.03,44.49 0 top
D7  94.9,36.74 270 top
D8  94.64,29.71 270 top
D9  94.64,23.3 270 top
D10  94.64,17.28 270 top
D11  94.64,11.77 270 top
D13  93.63,68.78 180 top
D31  41.91,59.56 90 top
H3  5.99,5.99 0 top
H4  75.49,5.99 0 top
H5  5.99,89 0 top
H6  87,89 0 top
IGN  114.95,67.26 90 top
JP1  97.79,79.12 90 top
L3  46.61,64.52 180 top
Q1  68.56,54.48 270 top
Q2  89.66,64.64 270 top
Q3  101.24,64.68 270 top
Q4  68.44,50.18 270 top
Q5  101.22,52.07 270 top
Q6  68.44,45.36 270 top
Q7  89.66,52.07 270 top
Q8  68.44,40.56 270 top
Q9  101.22,39.62 270 top
Q10  68.44,36.05 270 top
Q11  89.66,39.62 270 top
Q12  68.44,31.8 270 top
Q13  101.24,27.03 270 top
Q14  68.44,27.42 270 top
Q15  89.66,27.18 270 top
Q16  68.44,23.03 270 top
Q17  101.22,14.61 270 top
Q18  68.44,18.65 270 top
Q19  89.66,14.61 270 top
Q20  68.44,13.76 270 top
R1  47.75,72.52 0 top
R2  59.26,49.66 270 top
R3  64.91,50.04 90 top
R6  59.26,54.34 270 top
R7  91.69,62.02 270 top
R16  64.91,54.72 90 top
R17  103.63,66.28 90 top
R18  103.63,41.99 90 top
R19  103.63,17.7 90 top
R20  103.63,11.62 90 top
R21  64.89,59.6 90 top
R22  59.26,44.97 270 top
R23  64.91,45.35 90 top
R24  91.69,56.79 270 top
R25  59.26,40.17 270 top
R26  64.91,40.55 90 top
R27  91.69,50.19 90 top
R28  59.26,35.79 270 top
R29  64.91,36.17 90 top
R30  91.56,44.59 270 top
R31  59.26,31.41 270 top
R32  64.91,31.79 90 top
R33  91.56,36.84 90 top
R34  59.26,27.02 270 top
R35  64.91,27.4 90 top
R36  91.59,29.68 90 top
R37  59.26,22.64 270 top
R38  64.91,23.02 90 top
R39  91.46,23.4 90 top
R40  59.26,18.26 270 top
R41  64.91,18.64 90 top
R42  91.21,17.13 90 top
R43  59.26,13.88 270 top
R44  64.91,14.26 90 top
R45  91.33,11.74 90 top
R59  103.63,35.91 90 top
R60  103.63,60.21 90 top
R61  103.63,54.13 90 top
R62  103.63,29.84 90 top
R63  103.63,23.77 90 top
R64  103.63,48.06 90 top
R69  37.21,71.12 0 top
R75  32.89,70.99 0 top
R76  36.58,78.23 90 top
R77  36.83,74.04 0 top
R80  34.54,64.39 180 top
R81  45.97,60.45 0 top
SOV_0.  108.46,67.26 0 top
SOV_1  115.04,61.21 90 top
SOV_1.  108.46,61.21 0 top
SOV_2  115.13,55.15 90 top
SOV_2.  108.46,55.15 0 top
SOV_3  115.22,49.09 90 top
SOV_3.  108.46,49.09 0 top
SOV_4  115.31,43.03 90 top
SOV_4.  108.46,43.03 0 top
SOV_5  115.41,36.97 90 top
SOV_5.  108.46,36.97 0 top
SOV_6  115.5,30.91 90 top
SOV_6.  108.46,30.91 0 top
SOV_7  115.59,24.86 90 top
SOV_7.  108.46,24.86 0 top
SOV_8  115.59,18.8 90 top
SOV_8.  108.46,18.8 0 top
SOV_9  115.59,12.74 90 top
SOV_9.  108.46,12.74 0 top
U$1  [PSAS_LOGO_10X10]  111.25,83.19 0 top
U$2  38.1,65.53 270 top

### Tracks (layer width: path | path; a pad name or v marks a point on that pad's centre or on a via)
+12V  (via drill 0.35)
  Top 0.508: R28.2 v60.82,34.79 v60.83,34.8 | v49.66,69.34 46.85,69.34
  Top 0.813: L3.2 44.61,66.2 | R1.1 46.85,69.34 46.85,67.81 46.23,67.18 45.59,67.18 44.61,66.2 | 44.61,66.2 41.93,68.87 C53.1 41.93,70.99 | 41.93,70.99 41.93,71.75 C52.1 41.55,73.68 42.16,74.3 C51.1 C50.1 43.07,77.08 41.91,78.23 33.4,78.23 30.48,75.31 30.48,66.17 32.26,64.39 R80.2 | R69.2 41.81,71.12 41.93,70.99
  Bottom 0.508: v60.83,34.8 61.47,34.8 61.78,35.11 61.78,41.95 62.23,42.4 62.23,49.66 51.69,60.2 51.69,68.2 50.55,69.34 v49.66,69.34
  Bottom 0.61: Q9.S 90.04,28.45 85.09,28.45 81.41,24.77 73.41,24.77 65.53,32.64 65.53,66.8 64.14,68.2 51.69,68.2
CTS_VI
  Bottom 0.406: JP1.4 77.34,81.66 69.22,73.53 69.22,47.12 70.36,45.97 75.69,45.97 CN10.13
FLY3
  Top 0.305: 48.63,58.41 C43.2
  Top 0.508: U$2.P$6 39.83,64.19 40.32,63.69 40.32,60.39 41.15,59.56 D31.C 43.69,59.56 45.59,57.66 47.88,57.66 48.63,58.41 | C43.2 48.61,59.07 L3.1
GND  (via drill 0.35)
  other vias: 15.24,88.9 27.94,88.9 40.64,88.9 53.34,88.9 66.04,88.9 78.74,88.9 91.44,88.9 104.14,88.9 116.84,88.9 116.84,76.2 104.14,76.2 91.44,75.56 78.74,76.2 66.04,76.2 53.34,76.2 40.64,76.2 27.94,76.2 15.24,76.2 2.54,76.2 2.54,63.5 27.94,63.5 53.34,63.5 2.54,50.8 27.94,50.8 40.64,50.8 53.34,50.8 53.34,38.1 40.64,38.1 27.94,38.1 2.54,38.1 2.54,25.4 27.94,25.4 40.64,25.4 53.34,25.4 53.34,12.7 40.64,12.7 27.94,12.7 15.24,12.7 2.54,12.7 15.24,2.54 27.94,2.54 40.64,2.54 53.34,2.54 66.04,2.54 78.74,2.54 104.14,2.54 116.84,2.54 15.24,66.04 71.12,51.31 71.12,47.5 71.12,43.69 71.12,40.89 72.64,38.48 71.12,33.27 62.48,28.7 62.48,24.38 62.48,19.81 61.47,16.76 62.61,32.89 62.48,37.47 62.48,51.05 62.74,41.91 32.89,74.55 41.78,66.93
  pour Bottom: 0,92.71 0,95 2.92,95 119.13,95 119.13,92.46 119.13,0 114.68,0 0,0 0,3.17 0,92.08
  pour Top: 0,95 119.13,95 119.13,92.71 119.13,0 116.59,0 0,0 0,2.16 0,81.03
N$1
  Top 0.508: R6.1 60.53,55.29 63.37,52.45 68.45,52.45 69.67,53.66 Q1.3
  Top 0.61: Q2.G 84.96,67.18 81.79,64.01 81.79,59.56 80.01,57.78 74.93,57.78 71.5,54.36 69.79,54.36 Q1.3
N$2
  Top 0.508: R17.1 107.96,65.38 108.46,65.88 SOV_0..A
N$3
  Top 0.508: R1.2 65.91,72.52 71.26,77.86 12V.REG.A
N$11
  Top 0.305: C43.1 R81.2
N$12
  Top 0.508: U$2.P$3 37.15,68.13 36.32,68.96 C47.2 33.89,69.09 R75.2 | R75.2 34.02,70.86 | R69.1 36.08,70.99 34.02,70.99 R75.2
N$13  (via drill 0.35)
  Top 0.508: v37.85,72.52 37.83,72.53 R77.2 38.23,74.44 38.23,76.07 37.67,76.63 R76.1 | v37.21,65.53 37.21,64.25 U$2.P$4
  Bottom 0.508: v37.21,65.53 37.21,68.71 37.85,69.34 v37.85,72.52
N$14
  Top 0.508: C47.1 32.27,67.17 33.4,66.04 34.42,66.04 35.44,65.01 R80.1
N$15
  Top 0.508: R81.1 44.9,60.63 44.9,61.41 39.43,66.88 U$2.P$1
N$16
  Top 0.508: R18.1 105.24,41.12 107.93,41.12 108.46,41.65 SOV_4..A
N$17
  Top 0.508: R19.1 105.28,16.82 107.87,16.82 108.46,17.41 SOV_8..A
N$18
  Top 0.508: SOV_9..A 108.46,11.36 107.83,10.72 R20.1
N$20
  Top 0.508: R59.1 105.17,35.04 107.91,35.04 108.46,35.59 SOV_5..A
N$21
  Top 0.508: R60.1 105.43,59.34 107.98,59.34 108.46,59.82 SOV_1..A
N$22
  Top 0.508: R61.1 106.38,53.28 107.85,53.28 108.46,53.89 SOV_2..A
N$23
  Top 0.508: R62.1 105.41,28.97 107.9,28.97 108.46,29.53 SOV_6..A
N$24
  Top 0.508: R63.1 105.58,22.9 107.89,22.9 108.46,23.47 SOV_7..A
N$25
  Top 0.508: R64.1 106.09,47.2 107.96,47.2 108.46,47.7 SOV_3..A
N$29
  Top 0.406: R7.2 93.58,61.07 D3.1
N$30
  Top 0.508: R2.1 60.77,50.61 63.63,47.75 68.2,47.75 69.54,49.09 Q4.3
  Top 0.61: Q3.G 96.79,67.22 95.35,65.79 92.08,65.79 89.66,63.37 89.66,60.33 87.12,57.78 84.96,57.78 83.06,55.88 83.06,52.96 80.26,50.16 69.55,50.16 Q4.3
N$31
  Top 0.508: R24.2 93.83,55.84 D4.1
N$32
  Top 0.508: R22.1 60.88,45.92 63.88,42.93 68.58,42.93 69.54,43.88 Q6.3
  Top 0.61: Q6.3 69.79,45.11 79.91,45.11 84.07,49.28 84.07,54.99 85.6,56.52 88.26,56.52 90.69,54.08 98.15,54.08 Q5.G
N$33
  Top 0.406: R27.2 91.84,51.3 D5.1
N$34
  Top 0.508: R25.1 60.6,41.12 63.37,38.35 68.58,38.35 69.6,39.37 69.6,40.51 Q8.3
  Top 0.61: Q7.G 86.67,54.61 84.99,52.94 84.99,47.79 79.75,42.55 70.23,42.55 69.54,41.85 Q8.3
N$36
  Top 0.406: D6.1 92.27,43.39 R30.2
N$37
  Top 0.508: R28.1 60.92,36.74 63.63,34.04 68.83,34.04 69.6,34.8 69.6,36 Q10.3
  Top 0.61: Q9.G 90.35,42.16 88.45,44.07 86.11,44.07 79.5,37.47 71.97,37.47 70.55,36.05 Q10.3
N$38
  Top 0.406: D7.1 91.37,37.69 91.48,37.79 R33.2
N$39
  Top 0.508: R31.1 60.61,32.36 63.37,29.59 68.33,29.59 69.54,30.8 Q12.3
  Top 0.61: Q11.G 86.48,42.16 79.29,34.98 74.35,34.98 71.17,31.8 Q12.3
N$40
  Top 0.508: R36.2 93.51,30.63 D8.1
N$41
  Top 0.508: R34.1 61.18,27.97 64.01,25.15 68.83,25.15 69.54,25.85 Q14.3 70.98,27.42
  Top 0.61: Q13.G 98.7,30.08 96.52,32.26 79.19,32.26 79.12,32.33 73.48,32.33 72.01,30.86 72.01,28.45 70.98,27.42
N$42
  Top 0.508: R39.2 93.44,24.35 D9.1
N$43
  Top 0.508: R37.1 60.74,23.59 63.5,20.83 68.71,20.83 69.54,21.66 Q16.3
  Top 0.61: Q15.G 85.34,29.72 83.52,27.9 83.52,19.86 80.81,17.14 74.17,17.14 72.14,19.18 72.14,21.84 70.99,22.99 69.58,22.99 Q16.3
N$44
  Top 0.508: R42.2 93.38,18.08 D10.1
N$45
  Top 0.508: R40.1 60.67,19.21 63.37,16.51 68.07,16.51 69.54,17.98 Q18.3
  Top 0.61: Q18.3 70.81,18.65 75.07,14.39 80.17,14.39 85.84,20.07 97.41,20.07 98.68,18.8 Q17.G
N$46
  Top 0.508: R45.2 91.36,12.72 D11.1
N$47
  Top 0.508: 63.75,11.68 60.61,14.82 R43.1
  Top 0.61: 63.75,11.68 67.82,11.68 69.54,13.4 Q20.3 72.84,13.76 73.26,13.34 81.03,13.34 84.84,17.14 Q19.G
N$54
  Top 0.406: D13.1 94.58,69.24 94.08,68.73 81.94,68.73 77.98,64.77 67.31,64.77 64.89,62.35 R21.2
RTS_VI
  Bottom 0.406: JP1.5 78.49,84.2 67.44,73.15 67.44,38.73 68.71,37.47 76.83,37.47 77.34,36.96 77.34,34.92 CN10.24
RX_VI  (via drill 0.35)
  Top 0.406: v83.06,59.56 83.06,58.42 81.15,56.52 CN10.6
  Bottom 0.406: v83.06,59.56 83.06,72.52 87.12,76.58 JP1.2
SOL_GPIO_0  (via drill 0.35)
  Top 0.406: R16.2 65.87,55.67 66.04,55.5 67.5,55.5 Q1.1 68.4,56.26 v70.1,56.26 | v83.44,31.11 83.44,29.84 80.52,26.92 80.52,22.99 79.76,22.23 77.34,22.23 CN10.33
  Bottom 0.406: v70.1,56.26 72.52,56.26 74.04,57.78 79.25,57.78 83.44,53.59 v83.44,31.11
SOL_GPIO_1  (via drill 0.35)
  Top 0.406: R3.2 67.3,50.99 Q4.1 68.65,51.12 70.1,52.58 v71.12,52.58
  Bottom 0.406: v71.12,52.58 72.9,52.58 75.31,50.16 76.83,50.16 77.34,49.66 77.34,47.62 CN10.14
SOL_GPIO_2  (via drill 0.35)
  Top 0.406: v55.12,40.89 v55.12,21.97 | v61.34,46.61 64.6,46.61 R23.2 67.43,46.3 Q6.1 67.48,46.35 73.28,46.35 74.55,47.62 77.34,47.62 CN10.12
  Bottom 0.406: 60.07,15.88 55.12,20.83 v55.12,21.97 | v55.12,40.89 55.12,41.66 60.07,46.61 v61.34,46.61
SOL_GPIO_3  (via drill 0.35)
  Top 0.406: R26.2 67.43,41.5 Q8.1 68.21,41.51 68.45,41.27 v68.45,40.64
  Bottom 0.406: v68.45,40.64 68.45,39.88 68.96,39.37 75.44,39.37 CN10.19
SOL_GPIO_4  (via drill 0.35)
  Top 0.406: R29.2 66,37.12 66.04,37.08 67.36,37.08 Q10.1 69.01,37 72.01,40.01 80.14,40.01 84.33,44.2 v84.33,45.47
  Bottom 0.406: CN10.4 80.52,59.05 84.33,55.24 v84.33,45.47
SOL_GPIO_5  (via drill 0.35)
  Top 0.406: R32.2 67.43,32.74 Q12.1 67.45,32.77 69.22,32.77 v70.23,33.78
  Bottom 0.406: CN10.21 72.64,36.2 v70.23,33.78
SOL_GPIO_6  (via drill 0.35)
  Top 0.406: R35.2 67.43,28.35 Q14.1 69.51,28.37 v70.48,29.34
  Bottom 0.406: CN10.23 74.8,33.66 v70.48,29.34
SOL_GPIO_7  (via drill 0.35)
  Top 0.406: v72.77,26.92 69.83,23.98 Q16.1 67.43,23.97 R38.2
  Bottom 0.406: CN10.26 77.34,29.84 75.69,29.84 v72.77,26.92
SOL_GPIO_8  (via drill 0.35)
  Top 0.406: v70.48,20.7 69.47,19.68 67.52,19.68 Q18.1 67.4,19.56 66.17,19.56 66.14,19.59 R41.2 | CN10.25 74.8,31.11 73.91,30.23 73.91,25.4 v72.01,23.5
  Bottom 0.406: v70.48,20.7 71.25,21.46 71.25,22.73 v72.01,23.5
SOL_GPIO_9  (via drill 0.35)
  Top 0.406: v70.61,16.89 68.45,14.73 67.46,14.73 Q20.1 66.57,14.71 66.07,15.21 R44.2 | v73.15,21.72 73.15,23.24 74.68,24.77 77.34,24.77 CN10.30
  Bottom 0.406: v70.61,16.89 73.15,19.43 v73.15,21.72
SOL_GPIO_10
  Top 1.016: Q2.D 89,64.64 92.03,67.68 D13.3 95.36,67.68 96.77,69.09 100.42,69.09 102.38,67.13 R17.2 103.63,68.32 104.78,69.47 109.98,69.47 113.46,66 IGN.1
SOL_GPIO_11
  Top 0.406: 94.78,63.78 94.94,63.94
  Top 1.016: D3.3 94.78,63.78 | 94.94,63.94 95.68,64.68 Q3.D 101.81,64.68 103.63,62.87 R60.2 103.63,62.25 104.76,63.38 110.02,63.34 113.42,59.94 SOV_1.1
SOL_GPIO_12
  Top 1.016: R61.2 103.63,56.3 104.64,57.31 110.37,57.27 113.79,53.85 115.1,53.85 SOV_2.1 | Q5.D 100.71,52.07 101.6,52.96 101.6,54.1 102.48,54.98 R61.2 | D4.3 101.97,57.92 103.63,56.26 R61.2
SOL_GPIO_13
  Top 1.016: SOV_3.1 113.72,47.82 110.09,51.45 104.77,51.49 103.63,50.36 R64.2 101.74,48.91 100.46,47.62 96.77,47.62 96,48.4 D5.3 96,51.49 94.66,52.83 90.3,52.83 89.53,52.07 Q7.D
SOL_GPIO_14
  Top 1.016: R18.2 103.63,44.28 104.64,45.29 110.32,45.26 113.81,41.76 SOV_4.1 | D6.3 102.36,45.59 103.63,44.32 R18.2 | Q9.D 100.84,39.62 101.47,40.26 101.47,42.29 102.02,42.84 R18.2
SOL_GPIO_15
  Top 1.016: SOV_5.1 115.39,35.69 114.05,35.69 110.3,39.44 105.15,39.47 103.63,37.96 R59.2 102.42,36.76 100.46,34.8 97.16,34.8 96.01,35.94 96.01,36.73 D7.3 96,38.36 94.74,39.62 Q11.D
SOL_GPIO_16
  Top 1.016: SOV_6.1 115.44,29.59 113.79,29.59 110.02,33.36 104.77,33.4 103.63,32.27 R62.2 103.08,30.69 101.73,29.34 101.73,28.19 100.58,27.05 98.72,27.05 Q13.D 97.18,27.03 95.76,28.45 95.76,29.69 D8.3
SOL_GPIO_17
  Top 1.016: SOV_7.1 113.7,23.59 109.87,27.41 105.02,27.45 103.63,26.07 R63.2 102.09,24.62 99.19,21.72 96.39,21.72 95.74,22.37 D9.3 95.74,24.66 94.23,26.16 90.55,26.16 89.53,27.18 Q15.D
SOL_GPIO_18
  Top 1.016: SOV_8.1 113.79,17.53 110.23,21.09 104.77,21.13 103.63,19.99 R19.2 102.75,18.55 101.73,17.53 101.73,16 100.33,14.61 Q17.D 97.03,14.61 95.89,15.75 95.89,17.14 D10.3
SOL_GPIO_19
  Top 1.016: SOV_9.1 115.55,11.43 114.05,11.43 110.59,14.89 105.02,14.93 103.63,13.54 R20.2 102.26,12.47 101.47,11.68 101.47,11.18 100.33,10.03 96.14,10.03 95.74,10.43 D11.3 95.74,13.35 94.49,14.61 Q19.D
TX_VI  (via drill 0.35)
  Top 0.406: v63.5,63.37 63.5,65.66 71.88,74.04 JP1.1
  Bottom 0.406: CN10.34 77.34,22.23 74.8,22.23 72.26,24.77 68.83,24.77 68.71,24.64 63.5,29.84 v63.5,63.37
VBATT
  Top 0.406: U$2.P$5 38.23,64.06 38.23,63.04
  Top 1.27: R6.2 58.29,53.34 57.22,52.27 | 57.22,48.64 57.22,52.27 | 57.22,48.64 57.22,43.94 | 57.22,43.94 57.22,39.24 | 57.22,39.24 57.22,34.8 | 57.22,34.8 57.22,30.48 | 57.22,30.48 57.22,26.16 | 57.22,26.16 57.22,21.97 | 57.22,21.97 57.22,17.4 | 57.22,17.4 57.22,12.83 | 57.22,12.83 57.22,11.99 59.56,9.65 70.36,9.65 71.75,11.05 86.11,11.05 Q19.S 87,11.94 87,6.22 88.7,4.51 BATTERY.1 | R43.2 57.27,12.88 57.22,12.83 | R40.2 57.37,17.26 57.22,17.4 | R37.2 57.55,21.64 57.22,21.97 | R34.2 57.36,26.02 57.22,26.16 | R31.2 57.3,30.41 57.22,30.48 | 57.23,34.79 57.22,34.8 | R25.2 57.29,39.17 57.22,39.24 | R22.2 57.25,43.97 57.22,43.94 | R2.2 57.24,48.66 57.22,48.64 | 57.22,52.27 55.65,53.85 39.88,53.85 36.45,57.28 C45.1 | C45.1 34.29,59.45 C46.1 29.45,59.83 25.91,63.37 25.91,77.22 28.52,79.83 R76.2 | C45.1 37.61,59.45 38.23,60.07 38.23,63.04
  Bottom 1.27: Q19.S Q17.S 101.98,12.06 104.39,14.48 104.39,24.51 | Q15.S 98.55,24.64 Q13.S 98.72,24.51 104.39,24.51 | 93.73,49.53 Q5.S 104.39,49.53 | 93.73,49.53 Q7.S | Q2.S 87.16,62.14 Q3.S 101.56,62.14 104.39,59.31 104.39,49.53 | 104.39,49.53 104.39,36.83 | 104.39,36.83 104.39,24.51 | 104.14,37.08 104.39,36.83 | Q11.S 90.42,37.08 93.73,40.39 93.73,49.53

### Text on the board
tPlace: To Valve Indicator Board / TX, RX, GND, CTS, RTS | + - | components between CN7 and CN10 / must be below 8.5mm in height | TSAR Actuator Controller / 2021/4/25, V2.2 | Jennifer Jordan: jejor2@pdx.edu, github.com/psas/tsar-hardware | + - | + | -
tNames: -BATT